# EAGLE design QWICCFeather_001 (EAGLE 9.1.3)
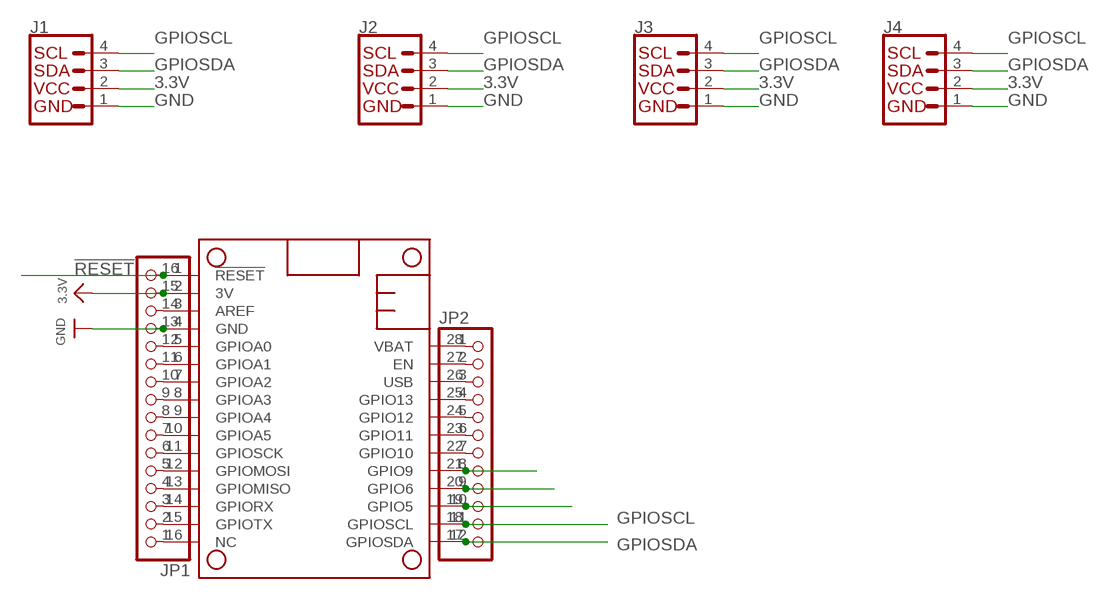
[diagram p0: schematic, sheet 1]

## Parts
J1  QWIIC_CONNECTORJS-1MM  [1X04_1MM_RA]
J2  QWIIC_CONNECTORJS-1MM  [1X04_1MM_RA]
J3  QWIIC_CONNECTORJS-1MM  [1X04_1MM_RA]
J4  QWIIC_CONNECTORJS-1MM  [1X04_1MM_RA]
JP1  HEADER-1X16ROUND  [1X16_ROUND]
JP2  HEADER-1X12  [1X12_ROUND]
MS1  FEATHERWING  [FEATHERWING]

## Nets
3.3V: J1.2(VCC) J2.2(VCC) J3.2(VCC) J4.2(VCC) JP1.15 MS1.2(3V)
!RESET: JP1.16 MS1.1(!RESET)
D5: JP2.10 MS1.19(GPIO5)
D6: JP2.9 MS1.20(GPIO6)
D9: JP2.8 MS1.21(GPIO9)
GND: J1.1(GND) J2.1(GND) J3.1(GND) J4.1(GND) JP1.13 MS1.4(GND)
GPIOSCL: J1.4(SCL) J2.4(SCL) J3.4(SCL) J4.4(SCL) JP2.11 MS1.18(GPIOSCL)
GPIOSDA: J1.3(SDA) J2.3(SDA) J3.3(SDA) J4.3(SDA) JP2.12 MS1.17(GPIOSDA)
N$8: JP1.1 MS1.16(NC)
N$9: JP1.2 MS1.15(GPIOTX)
N$10: JP1.3 MS1.14(GPIORX)
N$11: JP1.4 MS1.13(GPIOMISO)
N$12: JP1.5 MS1.12(GPIOMOSI)
N$13: JP1.6 MS1.11(GPIOSCK)
N$14: JP1.7 MS1.10(GPIOA5)
N$15: JP1.8 MS1.9(GPIOA4)
N$16: JP1.9 MS1.8(GPIOA3)
N$17: JP1.10 MS1.7(GPIOA2)
N$18: JP1.11 MS1.6(GPIOA1)
N$19: JP1.12 MS1.5(GPIOA0)
N$20: JP1.14 MS1.3(AREF)
N$21: JP2.2 MS1.27(EN)
N$22: JP2.4 MS1.25(GPIO13)
N$23: JP2.5 MS1.24(GPIO12)
N$24: JP2.6 MS1.23(GPIO11)
N$25: JP2.7 MS1.22(GPIO10)
USB: JP2.3 MS1.26(USB)
VBAT: JP2.1 MS1.28(VBAT)

## Library data of the parts
J1-J4 = SparkFun-Connectors:QWIIC_CONNECTOR: SparkFun I2C Standard Qwiic Connector An SMD 1mm pitch JST connector makes it easy and quick (get it? Qwiic?) to connect I2C devices to each other. The Qwiic system <http://www.sparkfun.com/qwiic> enables fast and solderless connection between popular platforms and various sensors and actuators. We carry 200mm <https://www.sparkfun.com/products/14204>, 100mm <https://www.sparkfun.com/products/14205>, 50mm <https://www.sparkfun.com/products/14206>, and breadboard friendly <https://www.sparkfun.com/products/14207> Qwiic cables. We also offer 10 pcs strips <https://www.sparkfun.com/products/14323> the SMD connectors.
JP1 = microbuilder:HEADER-1X16: PIN HEADER
JP2 = microbuilder:HEADER-1X12
MS1 = microbuilder:FEATHERWING

## Board
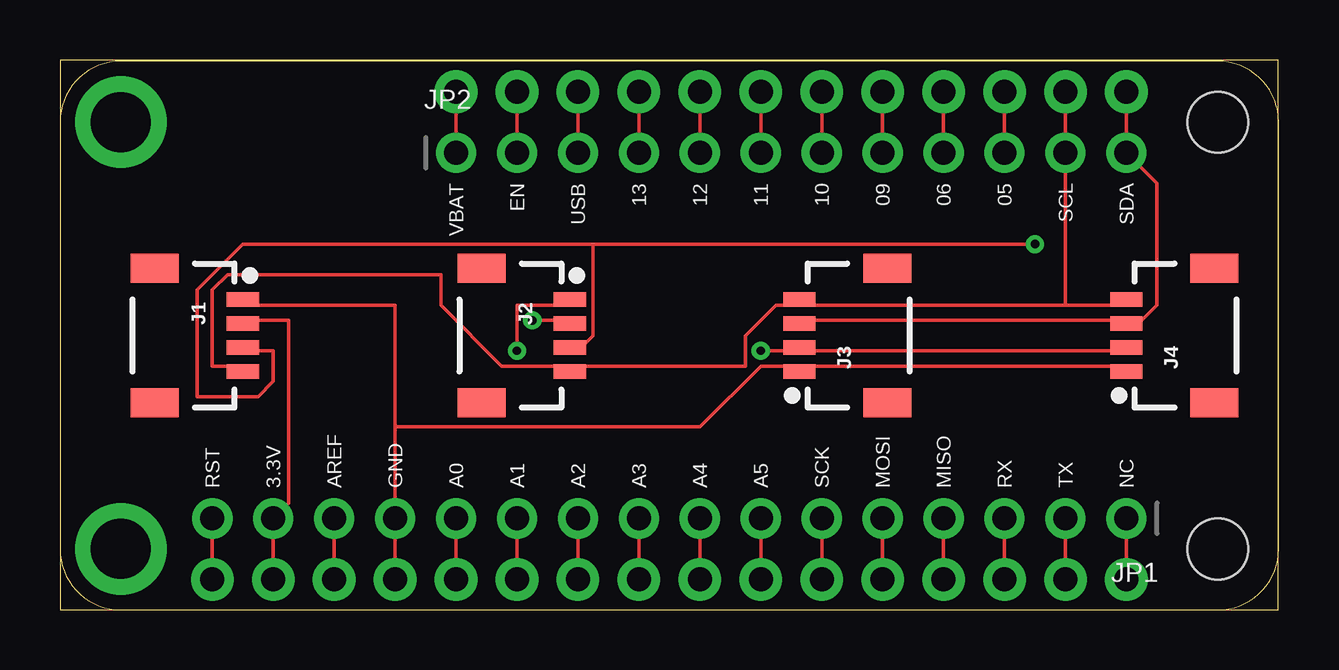
[diagram p1: board, top side]
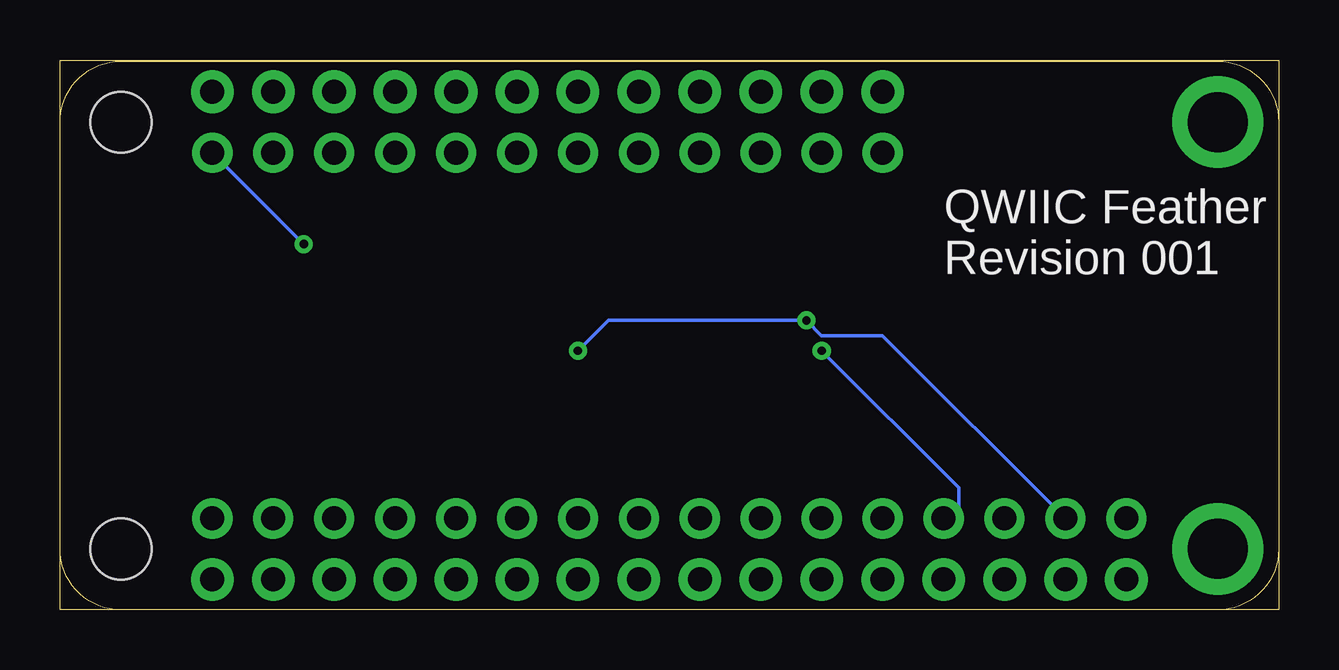
[diagram p2: board, bottom side, seen from below]

Size 50.8 x 22.91 mm. Coordinates in mm from the lower left corner, seen from the top.
Outline: 0,0 2.54,0 48.26,0 50.78,0 50.78,22.91 0,22.91 0,20.95 0,1.91 0,0
Copper layers (1*16): Top 0.035mm / dielectric 1.5mm / Bottom 0.035mm
Design rules "default": minimum track width 6mil, minimum drill 0.35mm, track to track 6mil, track to pad 6mil, pad to pad 6mil, via to via 6mil, smd to smd 6mil, copper to edge 40mil, drill to drill 6mil, minimum pad ring 10mil, minimum via ring 8mil, stop-mask expansion 4mil, vias tented up to drill 0mil, thermal gap 10mil

### Footprints (pad centres in the part's own frame; a part is rotated, then mirrored left to right if it is on the bottom)
1X04_1MM_RA = smd 0.6 x 1.35: 1 -1.5,0; 2 -0.5,0; 3 0.5,0; 4 1.5,0 | smd 1.2 x 2: NC1 2.8,-3.675; NC2 -2.8,-3.675
1X16_ROUND = drill 1 pad 1.676: 1 -19.05,0; 2 -16.51,0; 3 -13.97,0; 4 -11.43,0; 5 -8.89,0; 6 -6.35,0; 7 -3.81,0; 8 -1.27,0; 9 1.27,0; 10 3.81,0; 11 6.35,0; 12 8.89,0; 13 11.43,0; 14 13.97,0; 15 16.51,0; 16 19.05,0
1X12_ROUND = drill 1 pad 1.676: 1 -13.97,0; 2 -11.43,0; 3 -8.89,0; 4 -6.35,0; 5 -3.81,0; 6 -1.27,0; 7 1.27,0; 8 3.81,0; 9 6.35,0; 10 8.89,0; 11 11.43,0; 12 13.97,0
FEATHERWING = drill 1 pad 1.778: 1 6.35,1.27; 2 8.89,1.27; 3 11.43,1.27; 4 13.97,1.27; 5 16.51,1.27; 6 19.05,1.27; 7 21.59,1.27; 8 24.13,1.27; 9 26.67,1.27; 10 29.21,1.27; 11 31.75,1.27; 12 34.29,1.27; 13 36.83,1.27; 14 39.37,1.27; 15 41.91,1.27; 16 44.45,1.27; 17 44.45,21.59; 18 41.91,21.59; 19 39.37,21.59; 20 36.83,21.59; 21 34.29,21.59; 22 31.75,21.59; 23 29.21,21.59; 24 26.67,21.59; 25 24.13,21.59; 26 21.59,21.59; 27 19.05,21.59; 28 16.51,21.59 | drill 2.5 pad 3.81: P$1 2.54,20.32; P$2 2.54,2.54 | hole 2.54: 48.26,20.32; 48.26,2.54

### Placement (x,y rotation side)
J1  7.62,11.43 270 top
J2  21.25,11.43 270 top
J3  30.82,11.43 90 top
J4  44.45,11.43 90 top
JP1  25.4,3.81 180 top
JP2  30.48,19.05 0 top
MS1  0,0 0 top

### Tracks (layer width: path | path; a pad name or v marks a point on that pad's centre or on a via)
3.3V  (via drill 0.35)
  Top 0.152: J4.2 43.82,10.8 31.12,10.8 J3.2 30.48,10.8 v29.21,10.8 | J1.2 7.62,12.07 9.52,12.07 9.52,4.45 JP1.15 MS1.2 | v19.69,12.07 20.95,12.07 J2.2
  Bottom 0.152: JP1.15 16.51,11.43 19.05,11.43 v19.69,12.07 27.94,12.07 v29.21,10.8
!RESET
  Top 0.152: MS1.1 JP1.16
D5
  Top 0.152: MS1.19 JP2.10
D6
  Top 0.152: MS1.20 JP2.9
D9
  Top 0.152: MS1.21 JP2.8
GND  (via drill 0.35)
  Top 0.152: J4.1 43.82,10.16 31.12,10.16 J3.1 30.48,10.16 29.21,10.16 26.67,7.62 13.97,7.62 | 13.97,7.62 JP1.13 MS1.4 | 13.97,7.62 13.97,12.7 7.62,12.7 J1.1 | v19.05,10.8 19.05,12.7 20.95,12.7 J2.1
  Bottom 0.152: v19.05,10.8 13.34,5.08 13.34,3.81 JP1.13
GPIOSCL
  Top 0.152: J1.4 7.62,10.16 6.35,10.16 6.35,13.34 6.98,13.97 15.88,13.97 15.88,12.7 18.41,10.16 20.95,10.16 J2.4 21.59,10.16 28.57,10.16 28.57,11.43 29.84,12.7 30.48,12.7 J3.4 31.12,12.7 41.91,12.7 | MS1.18 JP2.11 41.91,12.7 | 41.91,12.7 43.82,12.7 J4.4
GPIOSDA  (via drill 0.35)
  Top 0.152: 22.23,15.24 7.62,15.24 5.71,13.34 5.71,8.89 8.26,8.89 8.89,9.52 8.89,10.8 7.62,10.8 J1.3 | 22.23,15.24 22.23,11.43 21.59,10.8 J2.3 | MS1.17 JP2.12 45.72,17.78 45.72,12.7 45.09,12.07 44.45,12.07 J4.3 43.82,12.07 31.12,12.07 J3.3 | v40.64,15.24 22.23,15.24
  Bottom 0.152: JP2.12 v40.64,15.24
N$8
  Top 0.152: MS1.16 JP1.1
N$9
  Top 0.152: MS1.15 JP1.2
N$10
  Top 0.152: MS1.14 JP1.3
N$11
  Top 0.152: MS1.13 JP1.4
N$12
  Top 0.152: MS1.12 JP1.5
N$13
  Top 0.152: MS1.11 JP1.6
N$14
  Top 0.152: MS1.10 JP1.7
N$15
  Top 0.152: MS1.9 JP1.8
N$16
  Top 0.152: MS1.8 JP1.9
N$17
  Top 0.152: MS1.7 JP1.10
N$18
  Top 0.152: MS1.6 JP1.11
N$19
  Top 0.152: MS1.5 JP1.12
N$20
  Top 0.152: MS1.3 JP1.14
N$21
  Top 0.152: MS1.27 JP2.2
N$22
  Top 0.152: MS1.25 JP2.4
N$23
  Top 0.152: MS1.24 JP2.5
N$24
  Top 0.152: MS1.23 JP2.6
N$25
  Top 0.152: MS1.22 JP2.7
USB
  Top 0.152: MS1.26 JP2.3
VBAT
  Top 0.152: MS1.28 JP2.1

### Text on the board
tPlace: VBAT | EN | USB | 13 | 12 | 11 | 10 | 09 | 06 | 05 | SCL | SDA | RST | 3.3V | AREF | GND | A0 | A1 | A2 | A3 | A4 | A5 | SCK | MOSI | MISO | RX | TX | NC
bPlace: QWIIC Feather / Revision 001